# Altium project Barracuda3D.PrjPcb
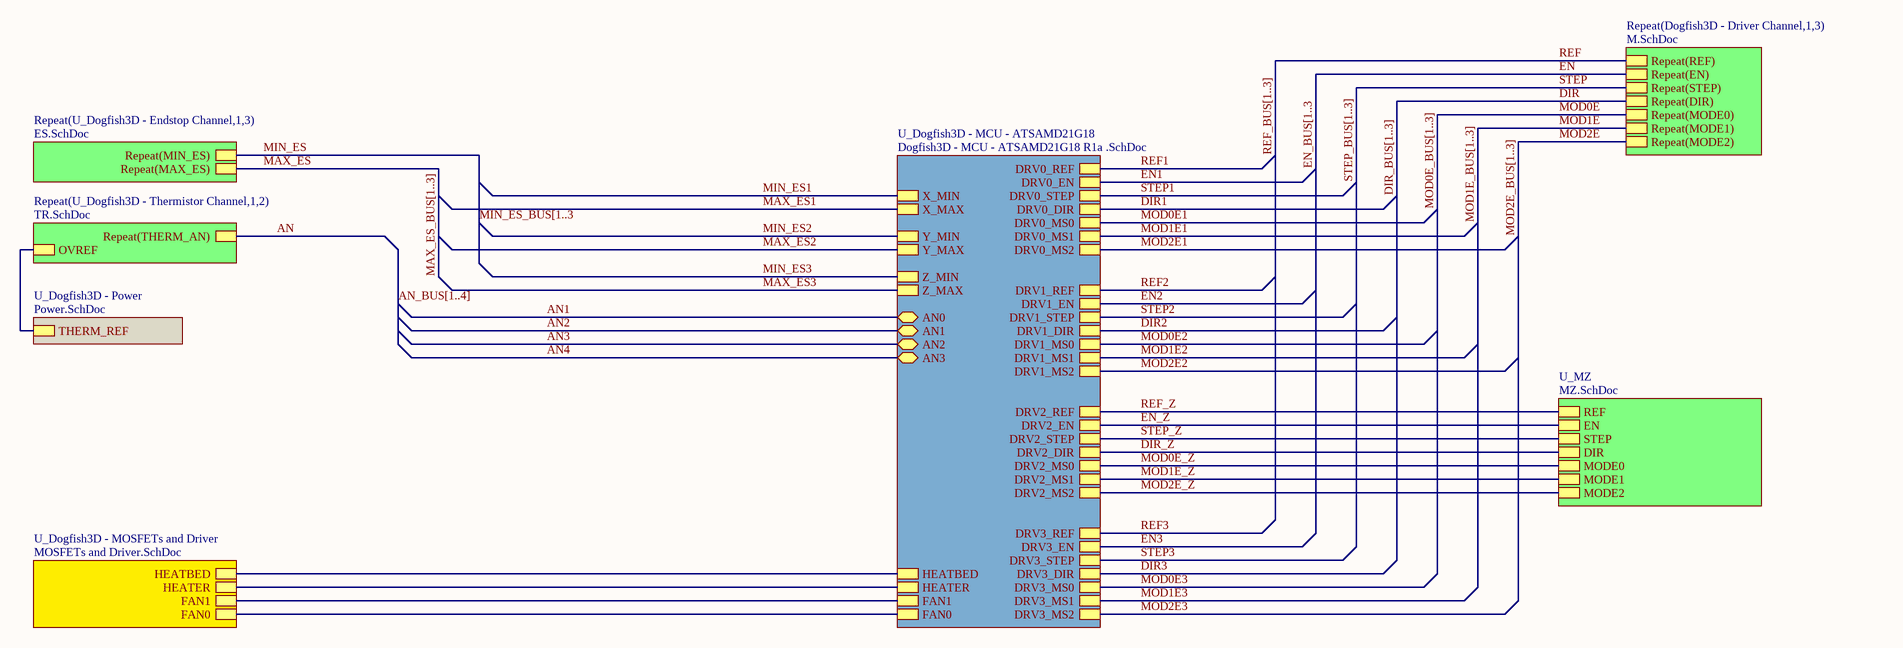
[diagram p0: Barracuda3D - System.SchDoc]
8 sheets, 225 parts. Net scope: hierarchical (ports join the sheet entries above them; power ports are global).
Board file: Barracuda3D.PcbDoc
Sheets:
  Barracuda3D - System.SchDoc
    Dogfish3D - Driver Channel1 = M.SchDoc
    Dogfish3D - Driver Channel2 = M.SchDoc
    Dogfish3D - Driver Channel3 = M.SchDoc
    U_Dogfish3D - Endstop Channel1 = ES.SchDoc
    U_Dogfish3D - Endstop Channel2 = ES.SchDoc
    U_Dogfish3D - Endstop Channel3 = ES.SchDoc
    U_Dogfish3D - MOSFETs and Driver = MOSFETs and Driver.SchDoc
    U_Dogfish3D - Power = Power.SchDoc
    U_Dogfish3D - Thermistor Channel1 = TR.SchDoc
    U_Dogfish3D - Thermistor Channel2 = TR.SchDoc
    U_Dogfish3D - MCU - ATSAMD21G18 = Dogfish3D - MCU - ATSAMD21G18 R1a .SchDoc
    U_MZ = MZ.SchDoc

## Sheet Barracuda3D - System.SchDoc
size B

### Sub-sheets
Repeat(Dogfish3D - Driver Channel,1,3) = M.SchDoc: Repeat(REF), Repeat(EN), Repeat(STEP), Repeat(DIR), Repeat(MODE0), Repeat(MODE1), Repeat(MODE2)
Repeat(U_Dogfish3D - Endstop Channel,1,3) = ES.SchDoc: Repeat(MAX_ES), Repeat(MIN_ES)
Repeat(U_Dogfish3D - Thermistor Channel,1,2) = TR.SchDoc: OVREF, Repeat(THERM_AN)
U_Dogfish3D - MCU - ATSAMD21G18 = Dogfish3D - MCU - ATSAMD21G18 R1a .SchDoc: DRV0_EN, DRV0_DIR, DRV0_STEP, DRV0_MS0, DRV0_MS1, DRV0_MS2, DRV0_REF, DRV1_EN, DRV1_DIR, DRV1_STEP, DRV1_MS0, DRV1_MS1, DRV1_MS2, DRV1_REF, DRV2_EN, DRV2_DIR, DRV2_STEP, DRV2_MS0, DRV2_MS1, DRV2_MS2, DRV2_REF, DRV3_EN, DRV3_DIR, DRV3_STEP, DRV3_MS0, DRV3_MS1, DRV3_MS2, DRV3_REF, X_MAX, X_MIN, Y_MAX, Y_MIN, Z_MAX, Z_MIN, FAN0, FAN1, HEATER, HEATBED, AN0, AN1, AN2, AN3
U_Dogfish3D - MOSFETs and Driver = MOSFETs and Driver.SchDoc: FAN0, FAN1, HEATER, HEATBED
U_Dogfish3D - Power = Power.SchDoc: THERM_REF
U_MZ = MZ.SchDoc: REF, EN, STEP, DIR, MODE0, MODE1, MODE2

### Nets
AN: sheet Repeat(U_Dogfish3D - Thermistor Channel,1,2)/Repeat(THERM_AN)
AN3: sheet U_Dogfish3D - MCU - ATSAMD21G18/AN2
AN4: sheet U_Dogfish3D - MCU - ATSAMD21G18/AN3
DIR: sheet Repeat(Dogfish3D - Driver Channel,1,3)/Repeat(DIR)
DIR_Z: sheet U_Dogfish3D - MCU - ATSAMD21G18/DRV2_DIR, sheet U_MZ/DIR
EN: sheet Repeat(Dogfish3D - Driver Channel,1,3)/Repeat(EN)
EN_Z: sheet U_Dogfish3D - MCU - ATSAMD21G18/DRV2_EN, sheet U_MZ/EN
MAX_ES: sheet Repeat(U_Dogfish3D - Endstop Channel,1,3)/Repeat(MAX_ES)
MIN_ES: sheet Repeat(U_Dogfish3D - Endstop Channel,1,3)/Repeat(MIN_ES)
MOD0E: sheet Repeat(Dogfish3D - Driver Channel,1,3)/Repeat(MODE0)
MOD0E_Z: sheet U_Dogfish3D - MCU - ATSAMD21G18/DRV2_MS0, sheet U_MZ/MODE0
MOD1E: sheet Repeat(Dogfish3D - Driver Channel,1,3)/Repeat(MODE1)
MOD1E_Z: sheet U_Dogfish3D - MCU - ATSAMD21G18/DRV2_MS1, sheet U_MZ/MODE1
MOD2E: sheet Repeat(Dogfish3D - Driver Channel,1,3)/Repeat(MODE2)
MOD2E_Z: sheet U_Dogfish3D - MCU - ATSAMD21G18/DRV2_MS2, sheet U_MZ/MODE2
PWM0: sheet U_Dogfish3D - MOSFETs and Driver/FAN0, sheet U_Dogfish3D - MCU - ATSAMD21G18/FAN0
PWM1: sheet U_Dogfish3D - MOSFETs and Driver/FAN1, sheet U_Dogfish3D - MCU - ATSAMD21G18/FAN1
PWM2: sheet U_Dogfish3D - MOSFETs and Driver/HEATER, sheet U_Dogfish3D - MCU - ATSAMD21G18/HEATER
PWM3: sheet U_Dogfish3D - MOSFETs and Driver/HEATBED, sheet U_Dogfish3D - MCU - ATSAMD21G18/HEATBED
REF: sheet Repeat(Dogfish3D - Driver Channel,1,3)/Repeat(REF)
REF_Z: sheet U_Dogfish3D - MCU - ATSAMD21G18/DRV2_REF, sheet U_MZ/REF
STEP: sheet Repeat(Dogfish3D - Driver Channel,1,3)/Repeat(STEP)
STEP_Z: sheet U_Dogfish3D - MCU - ATSAMD21G18/DRV2_STEP, sheet U_MZ/STEP
NetD18_C: sheet U_Dogfish3D - Power/THERM_REF, sheet Repeat(U_Dogfish3D - Thermistor Channel,1,2)/OVREF

### Buses and harness runs
bus AN_BUS[1..4]
bus DIR_BUS[1..3]
bus EN_BUS[1..3
bus MAX_ES_BUS[1..3]
bus MIN_ES_BUS[1..3
bus MOD0E_BUS[1..3]
bus MOD1E_BUS[1..3]
bus MOD2E_BUS[1..3]
bus REF_BUS[1..3]
bus STEP_BUS[1..3]

## Sheet M.SchDoc
size A
Used 3 times, as channels Dogfish3D - Driver Channel1, Dogfish3D - Driver Channel2, Dogfish3D - Driver Channel3. Parts and nets are listed once, with the designators drawn on the sheet.
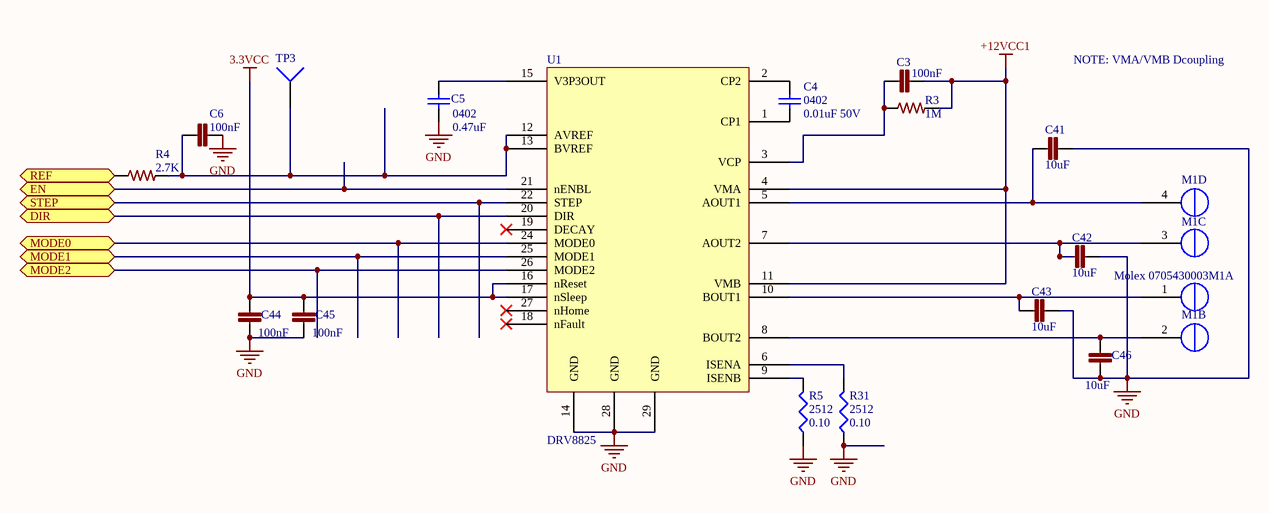
[diagram p1: M.SchDoc]

### Parts
C3  100nF  [C0603]
C4  value 0.01uF 50V  [C0402]  (hidden comment: 0402)
C5  value 0.47uF  [C0402]  (hidden comment: 0402)
C6  100nF  [C0402]
C41  10uF  [C0603]
C42  10uF  [C0603]
C43  10uF  [C0603]
C44  100nF  [C0402]
C45  100nF  [C0402]
C46  10uF  [C0603]
M1  Molex 0705430003  [4POL254]  (parts A,B,C,D of 4)
R3  1M  [R0402]
R4  2.7K  [R0402]
R5  2512  value 0.10  [2512R-0.55]
R31  2512  value 0.10  [2512R-0.55]
TP3  TP4  [TP-2]  (value not drawn)
U1  DRV8825  [DRV8825PWPR]

### Ports
DIR, EN, MODE0, MODE1, MODE2, REF, STEP

### Nets
3.3VCC: C44.1 C45.1 U1.16(nReset) U1.17(nSleep)
+12VCC1: C3.2 R3.2 U1.4(VMA) U1.11(VMB)
GND: C5.1 C6.1 C41.2 C42.2 C43.2 C44.2 C45.2 C46.2 R5.1 R31.1 U1.14(GND) U1.28(GND) U1.29(GND)
DIR: U1.20(DIR) ; port DIR
EN: U1.21(nENBL) ; port EN
MODE0: U1.24(MODE0) ; port MODE0
MODE1: U1.25(MODE1) ; port MODE1
MODE2: U1.26(MODE2) ; port MODE2
REF: R4.1 ; port REF
STEP: U1.22(STEP) ; port STEP
NetC3_1: C3.1 R3.1 U1.3(VCP)
NetC4_1: C4.1 U1.1(CP1)
NetC4_2: C4.2 U1.2(CP2)
NetC5_2: C5.2 U1.15(V3P3OUT)
NetC6_2: C6.2 R4.2 TP3.1 U1.12(AVREF) U1.13(BVREF)
NetC41_1: C41.1 M1.4(OUT1B) U1.5(AOUT1)
NetC42_1: C42.1 M1.3(OUT1A) U1.7(AOUT2)
NetC43_1: C43.1 M1.1(OUT2B) U1.10(BOUT1)
NetC46_1: C46.1 M1.2(OUT2A) U1.8(BOUT2)
NetR5_2: R5.2 U1.9(ISENB)
NetR31_2: R31.2 U1.6(ISENA)

Not connected (* = marked no-connect by the designer): U1 18(nFault)* 19(DECAY)* 23(NC) 27(nHome)*

### Channels
Dogfish3D - Driver Channel1: designators end in D; ports DIR=DIR1 EN=EN1 MODE0=MOD0E1 MODE1=MOD1E1 MODE2=MOD2E1 REF=REF1 STEP=STEP1
Dogfish3D - Driver Channel2: designators end in B; ports DIR=DIR2 EN=EN2 MODE0=MOD0E2 MODE1=MOD1E2 MODE2=MOD2E2 REF=REF2 STEP=STEP2
Dogfish3D - Driver Channel3: designators end in C; ports DIR=DIR3 EN=EN3 MODE0=MOD0E3 MODE1=MOD1E3 MODE2=MOD2E3 REF=E0_DRV_REF STEP=STEP3

### Notes on the sheet
- NOTE: VMA/VMB Dcoupling

### Library data of the parts
C3 = C0603C104K5RACTU: CAP CER 0603 100nF 50V 10% X7R; LastRevisionNote: ImportComponents; Published: 23-Apr-2014; Publisher: UltiMachine; LastRevisionDate: 23-Apr-2014; ManufacturerPartNumber: C0603C104K5RACTU; VALUE: 100nF
C4 = GRM155R71H103JA88D: CAP CER 10000PF 50V X7R 0402; MFR: Murata; Tolerance: 10%; Voltage: 6.3VDC; Published: 10 - Dec - 2014; LatestRevisionDate: 10 - Dec - 2014; LatestRevisionNote: Ultimachine Footprint Added; Publisher: Ultimachine; Component Type: Chip Capacitor; MFR Part #: GRM155R71H103JA88D; Part Description: CAP CER 10000PF 50V X7R 0402; Mounting Type: SMT 0402; Datasheet: http://search.murata.co.jp/Ceramy/image/img/A01X/G101/ENG/GRM155R71H103JA88-01.pdf; Height: 0.5 ±0.05mm; Digikey #: 490-7763-1-ND; PackageReference: 0402
C5 = GRM155R60J474KE19D: 0.47uF 6.3v C0402 - GRM155R60J474KE19D; MFR: Murata; Part Description: CAP CER 0.47UF 6.3V 10% X5R 0402; Tolerance: 10%; Voltage: 6.3VDC; Published: 10 - Dec - 2014; LatestRevisionDate: 10 - Dec - 2014; LatestRevisionNote: Ultimachine Footprint Added; Publisher: Ultimachine; Component Type: Chip Capacitor; MFR Part #: GRM155R60J474KE19D; Mounting Type: SMT 0402; Datasheet: http://search.murata.co.jp/Ceramy/image/img/A01X/G101/ENG/GRM155R60J474KE19-01.pdf; Height: 0.5 ±0.05mm; PackageReference: 0402
C6 C44 C45 = GRM155R71C104KA88D: CAP CER 0402 100nF 16V 10% X7R; LastRevisionNote: ImportComponents; Published: 23-Apr-2014; Publisher: UltiMachine; LastRevisionDate: 23-Apr-2014; ManufacturerPartNumber: GRM155R71C104KA88D; VALUE: 100nF
C41-C43 C46 = CC0603ZRY5V6BB105: CAP CER 0603 1uF 10V Y5V; LastRevisionNote: ImportComponents; Published: 23-Apr-2014; Publisher: UltiMachine; LastRevisionDate: 23-Apr-2014; ManufacturerPartNumber: CC0603ZRY5V6BB105; VALUE: 10uF
M1 = Molex 0705430003 Alt: Molex 4 Pin Clip Connector
R3 = ERJ2GEJ105X: RES 0402 1M 100mW 5%; LastRevisionNote: ImportComponents; Published: 23-Apr-2014; Publisher: UltiMachine; LastRevisionDate: 23-Apr-2014; ManufacturerPartNumber: ERJ2GEJ105X; VALUE: 1M
R4 = ERJ-2RKF2701X: RES SMD 2.7K OHM 1% 1/10W 0402; Manufacturer: Panasonic; ManufacturerPartNumber: ERJ2GEJ105X; LastRevisionNote: ImportComponents; Published: 23-Apr-2014; Publisher: Adam; LastRevisionDate: 23-Apr-2014; VALUE: 2.7K
R5 R31 = CSRN2512FTR100: RES SMD 0.1 OHM 1% 2W 2512; MFR: Stackpole ELectronics Inc; PackageReference: 2512; MFR #: CSRN2512FTR100; Digikey #: CSRN2512FTR100TR-ND; PDF: http://www.seielect.com/catalog/SEI-CSR_CSRN.pdf
TP3 = Socket: LatestRevisionDate: 17-Jul-2002; LatestRevisionNote: Re-released for DXP Platform.; Publisher: Altium Limited
U1 = DRV8825: DRV8825 Ti Stepper Driver; Manufacture: Texas Instruments; Mountining Type: SMD - Ti PowerPAD Package; Voltage: 8.2-45VDC; Cost (1000 qty): 2.25; Part Number: DRV8825PWPR; Status: In-Production; Pins: 28 Pins and one Exposed Pad; Datasheet: http://www.ti.com/lit/gpn/drv8825; Height: 1.2mm; Tolerance: N/A; Type: Stepper Driver - Integrated Circuit; Lead Free: YES

## Sheet ES.SchDoc
size A
Used 3 times, as channels U_Dogfish3D - Endstop Channel1, U_Dogfish3D - Endstop Channel2, U_Dogfish3D - Endstop Channel3. Parts and nets are listed once, with the designators drawn on the sheet.
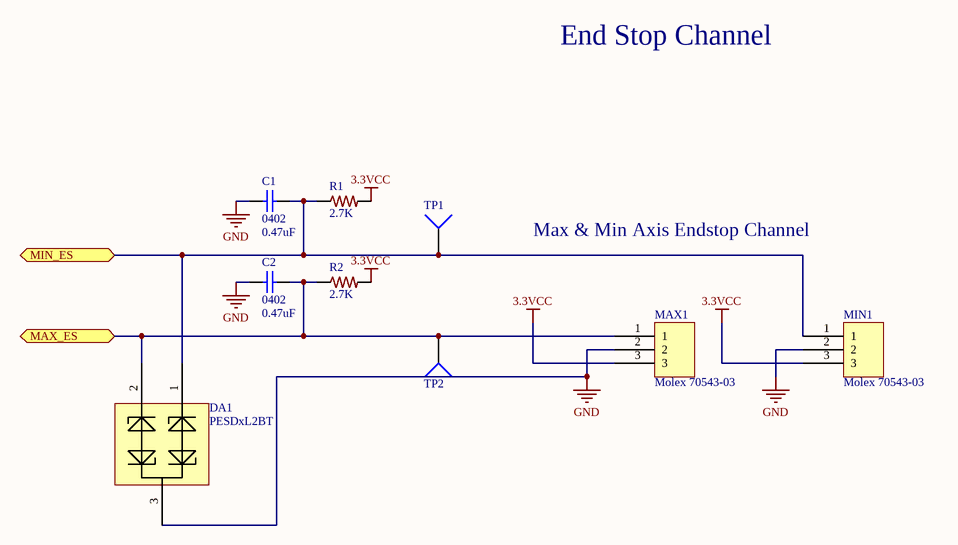
[diagram p2: ES.SchDoc]

### Parts
C1  value 0.47uF  [C0402]  (hidden comment: 0402)
C2  value 0.47uF  [C0402]  (hidden comment: 0402)
DA1  PESDxL2BT  [SOT95P230X110-3N]
MAX1  Molex 70543-03  [70543-03]
MIN1  Molex 70543-03  [70543-03]
R1  2.7K  [R0402]
R2  2.7K  [R0402]
TP1  TP4  [TP-2]  (value not drawn)
TP2  TP4  [TP-2]  (value not drawn)

### Ports
MAX_ES, MIN_ES

### Nets
3.3VCC: MAX1.3 MIN1.3 R1.2 R2.2
GND: C1.2 C2.2 DA1.3 MAX1.2 MIN1.2
MAX_ES: C2.1 DA1.2 MAX1.1 R2.1 TP2.1 ; port MAX_ES
MIN_ES: C1.1 DA1.1 MIN1.1 R1.1 TP1.1 ; port MIN_ES

### Channels
U_Dogfish3D - Endstop Channel1: designators end in A; ports MAX_ES=MAX_ES1 MIN_ES=MIN_ES1
U_Dogfish3D - Endstop Channel2: designators end in B; ports MAX_ES=MAX_ES2 MIN_ES=MIN_ES2
U_Dogfish3D - Endstop Channel3: designators end in C; ports MAX_ES=MAX_ES3 MIN_ES=MIN_ES3

### Notes on the sheet
- End Stop Channel
- Max & Min Axis Endstop Channel

### Library data of the parts
C1 C2 = GRM155R60J474KE19D: as C5 on sheet M; Published: 10 - Dec - 2014; LatestRevisionDate: 10 - Dec - 2014; LatestRevisionNote: Ultimachine Footprint Added; Publisher: Ultimachine; Component Type: Chip Capacitor; MFR Part #: GRM155R60J474KE19D; Mounting Type: SMT 0402; Datasheet: http://search.murata.co.jp/Ceramy/image/img/A01X/G101/ENG/GRM155R60J474KE19-01.pdf; Height: 0.5 ±0.05mm; PackageReference: 0402
DA1 = PESDxL2BT: PESDxL2BT TVS Diode Array 2x
MAX1 MIN1 = Molex Endstop
R1 R2 = ERJ-2GEJ272X: RES SMD 2.7K OHM 5% 1/10W 0402; LastRevisionNote: ImportComponents; Published: 23-Apr-2014; Publisher: Adam Vadala-Roth; LastRevisionDate: 23-Apr-2014; ManufacturerPartNumber: ERJ-2GEJ272X; Digikey #: P2.7KJCT-ND; Tolerance: 5%; Mounting type: SMD; VALUE: 2.7K
TP1 TP2 = Socket: LatestRevisionDate: 17-Jul-2002; LatestRevisionNote: Re-released for DXP Platform.; Publisher: Altium Limited

## Sheet MOSFETs and Driver.SchDoc
size A
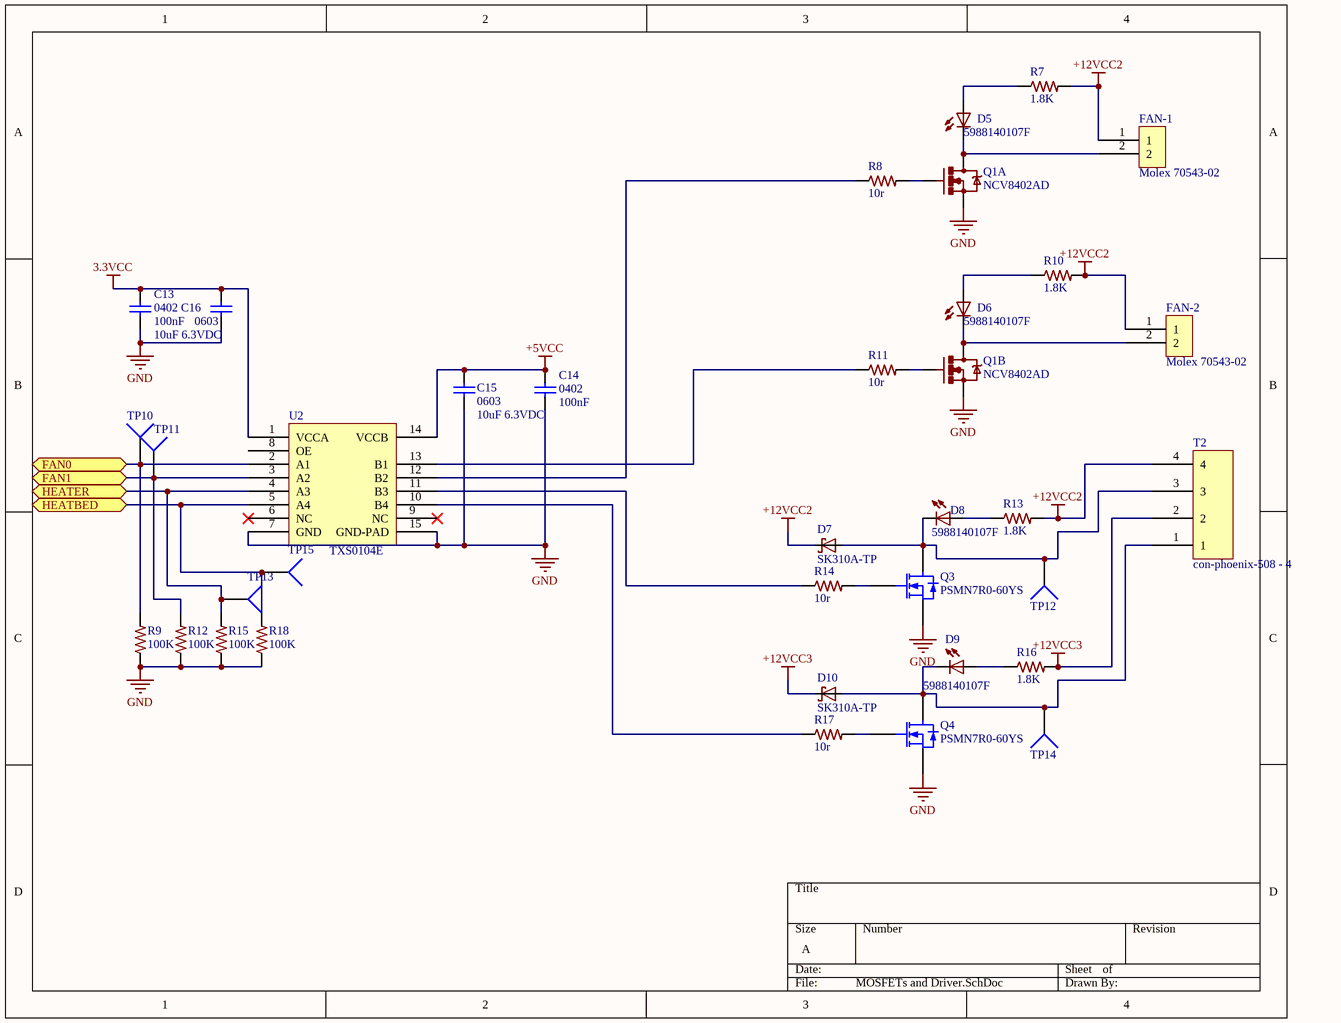
[diagram p3: MOSFETs and Driver.SchDoc]

### Parts
C13  value 100nF  [C0402]  (hidden comment: 0402)
C14  value 100nF  [C0402]  (hidden comment: 0402)
C15  0603  value 10uF 6.3VDC  [C0603]
C16  0603  value 10uF 6.3VDC  [C0603]
D5  5988140107F  [LED2012120]
D6  5988140107F  [LED2012120]
D7  SK310A-TP  [SMA-SM]
D8  5988140107F  [LED2012120]
D9  5988140107F  [LED2012120]
D10  SK310A-TP  [SMA-SM]
FAN-1  Molex 70543-02  [70543-02]
FAN-2  Molex 70543-02  [70543-02]
Q1  NCV8402AD  [NCV8402AD-SOIC8]  (parts A,B of 2)
Q3  PSMN7R0-60YS  [PSMN7R0-60YS]
Q4  PSMN7R0-60YS  [PSMN7R0-60YS]
R7  1.8K  [R0603]
R8  10r  [R0603]
R9  100K  [R0402]
R10  1.8K  [R0603]
R11  10r  [R0603]
R12  100K  [R0402]
R13  1.8K  [R0603]
R14  10r  [R0603]
R15  100K  [R0402]
R16  1.8K  [R0603]
R17  10r  [R0603]
R18  100K  [R0402]
T2  con-phoenix-508 - 4  [MSTBV4]
TP10  TP4  [TP-2]  (value not drawn)
TP11  TP4  [TP-2]  (value not drawn)
TP12  TP4  [TP-2]  (value not drawn)
TP13  TP4  [TP-2]  (value not drawn)
TP14  TP4  [TP-2]  (value not drawn)
TP15  TP4  [TP-2]  (value not drawn)
U2  TXS0104E  [RGY  (S-PVQFN-N14)]

### Ports
FAN0, FAN1, HEATBED, HEATER

### Nets
3.3VCC: C13.2 C16.2 U2.1(VCCA)
+5VCC: C14.2 C15.2 U2.14(VCCB)
+12VCC2: D7.C FAN-1.1 FAN-2.1 R7.2 R10.2 R13.2 T2.4
+12VCC3: D10.C R16.2 T2.2
GND: C13.1 C14.1 C15.1 C16.1 Q1.1(S) Q1.3(S) Q3.1(S) Q3.2(S) Q3.3(S) Q4.1(S) Q4.2(S) Q4.3(S) R9.1 R12.1 R15.1 R18.1 U2.7(GND) U2.15(GND-PAD)
PWM0: R9.2 TP10.1 U2.2(A1) ; port FAN0
PWM1: R12.2 TP11.1 U2.3(A2) ; port FAN1
PWM2: R15.2 TP13.1 U2.4(A3) ; port HEATER
PWM3: R18.2 TP15.1 U2.5(A4) ; port HEATBED
NetD5_A: D5.A R7.1
NetD5_C: D5.C FAN-1.2 Q1.7(D)
NetD6_A: D6.A R10.1
NetD6_C: D6.C FAN-2.2 Q1.5(D)
NetD7_A: D7.A D8.C Q3.5(D) T2.3 TP12.1
NetD8_A: D8.A R13.1
NetD9_A: D9.A R16.1
NetD9_C: D9.C D10.A Q4.5(D) T2.1 TP14.1
NetQ1_2: Q1.2(G) R8.2
NetQ1_4: Q1.4(G) R11.2
NetQ3_4: Q3.4(G) R14.2
NetQ4_4: Q4.4(G) R17.2
NetR8_1: R8.1 U2.12(B2)
NetR11_1: R11.1 U2.13(B1)
NetR14_1: R14.1 U2.11(B3)
NetR17_1: R17.1 U2.10(B4)

Not connected (* = marked no-connect by the designer): U2 6(NC)* 8(OE) 9(NC)*

### Library data of the parts
C13 C14 = GRM155R71C104KA88D: CAP CER 0.1UF (100nF) 16V 10% X7R 0402; MFR: Murata; Part Description: CAP CER 0.1UF 16V 10% X7R 0402; Published: 10 - Dec - 2014; LatestRevisionDate: 10 - Dec - 2014; LatestRevisionNote: Ultimachine Footprint Added; Publisher: Ultimachine; Component Type: Chip Capacitor; MFR Part #: GRM155R71C104KA88D; Mounting Type: SMT 0402; Datasheet: http://psearch.murata.com/capacitor/product/GRM155R71C104KA88%23.pdf; Height: 0.5 ±0.05mm; Tolerance: 10%; Voltage: 16v; PackageReference: 0402
C15 C16 = C1608JB0J106K080AB: CAP CER 10UF 6.3V 10% JB 0603; MFR: TDK; Voltage: 6.3VDC; Published: 10 - Dec - 2014; LatestRevisionDate: 10 - Dec - 2014; Component Type: Chip Capacitor; MFR Part #: C1608JB0J106K080AB; Part Description: CAP CER 10UF 6.3V 10% JB 0603; Mounting Type: SMT 0603; Datasheet: http://www.tdk.com/pdf/TDKMLCCCapRange.pdf; Height: 0.9mm; Tolerance: 10%; Digikey #: 445-11185-1-ND; PackageReference: 0402
D5 D6 D8 D9 = 5988140107F: LED 0805 Yellow; LastRevisionNote: ImportComponents; Published: 23-Apr-2014; Publisher: UltiMachine; LastRevisionDate: 23-Apr-2014; VALUE: 5988140107F
D7 D10 = SK310A: DIODE Schottky 3A SMA; LastRevisionNote: ImportComponents; LastRevisionDate: 23-Apr-2014; ManufacturerPartNumber: SK310A; Published: 23-Apr-2014; Publisher: UltiMachine
Q3 Q4 = PSMN7R0-60YS: N-Channel MOSFET; Published: 8-Jun-2000; LatestRevisionDate: 17-Jul-2002; LatestRevisionNote: Re-released for DXP Platform.; PackageVersion: 1995/1996; PackageReference: E3; Publisher: Altium Limited; PackageDescription: TO, Flat Index; 3 In-Line, Axial Leads; Body Dia. 4.6mm; Lead Dia. 0.5 mm (max)
R7 R10 R13 R16 = RC0603JR-071K8L: RES 0603 1.8K 100mW 5%; LastRevisionNote: ImportComponents; Published: 23-Apr-2014; Publisher: UltiMachine; LastRevisionDate: 23-Apr-2014; ManufacturerPartNumber: RC0603JR-071K8L; VALUE: 1.8K
R8 R11 R14 R17 = CRCW060310R0FKEA: RES 0603 10r 100mW 1%; LastRevisionNote: ImportComponents; Published: 23-Apr-2014; Publisher: UltiMachine; LastRevisionDate: 23-Apr-2014; ManufacturerPartNumber: CRCW060310R0FKEA; VALUE: 10r
R9 R12 R15 R18 = RC1005F104CS: RES SMD 100K OHM 1% 1/16W 0402; Manufacturer: Samsung; LastRevisionNote: ImportComponents; Digilkey #: 1276-3432-1-ND; Published: 23-Apr-2014; Publisher: UltiMachine; LastRevisionDate: 23-Apr-2014; ManufacturerPartNumber: RC1005F104CS; VALUE: 100K
T2 = con-phoenix-508_4
TP10-TP15 = Socket: LatestRevisionDate: 17-Jul-2002; LatestRevisionNote: Re-released for DXP Platform.; Publisher: Altium Limited
U2 = TXS0104E: TXS0104E - Bidriectional Opendrain/pushpull level shift; MFR: Texas Instruments; MFR Part #: TXS0104ERGYR; Active: Yes; Digikey Part #: 296-20698-2-ND; Height: 1mm; mounting Type: SMD; Datasheet: http://www.ti.com/lit/ds/symlink/txs0104e.pdf; Lead Free ?: RhoS

## Sheet Power.SchDoc
size A
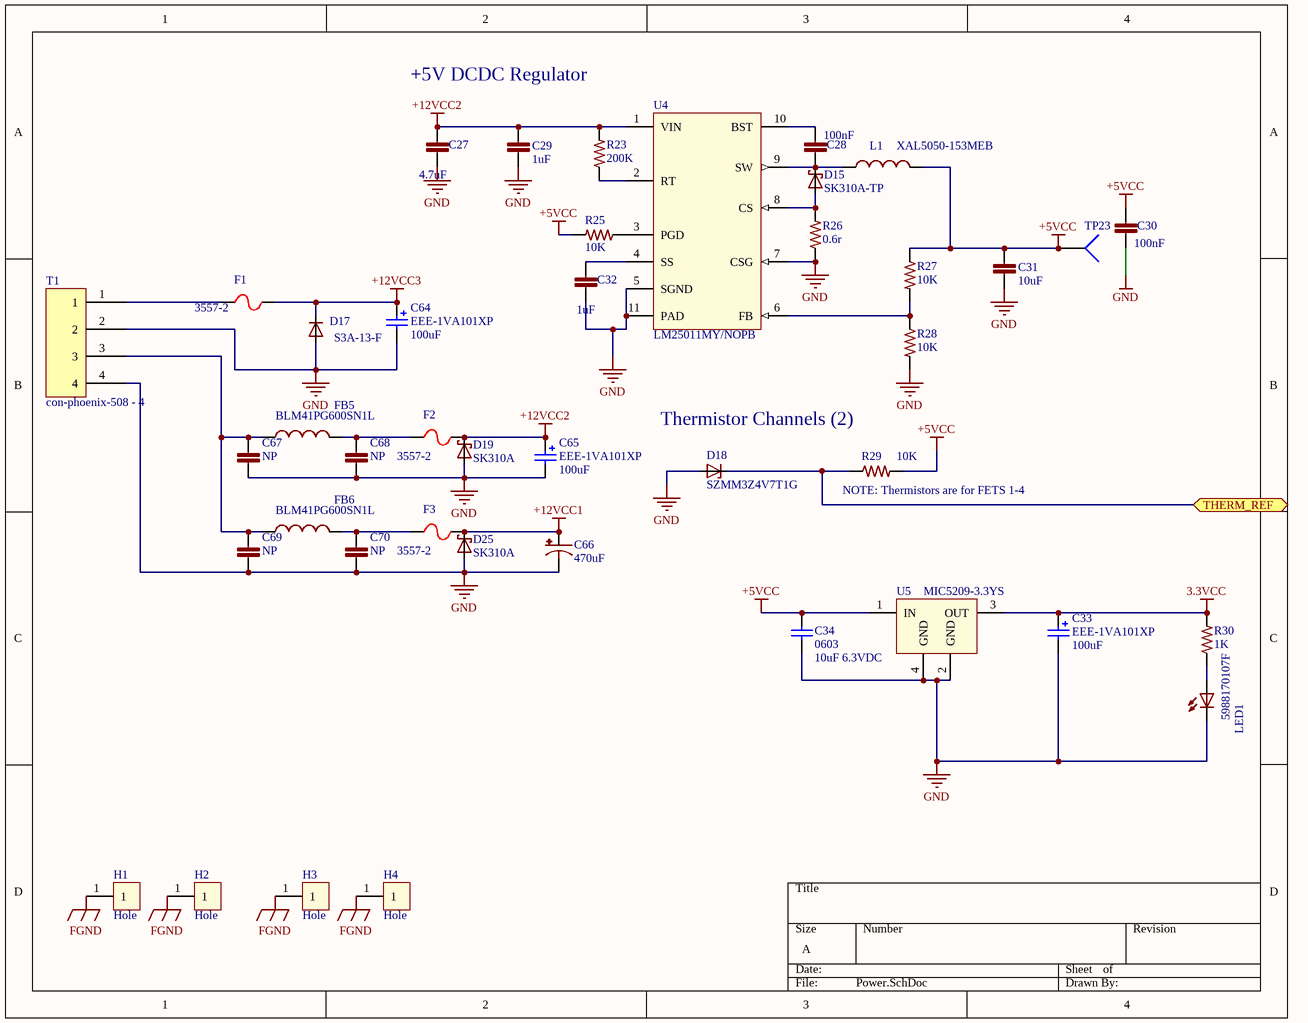
[diagram p4: Power.SchDoc]

### Parts
C27  4.7uF  [C1206]
C28  100nF  [C0603]
C29  1uF  [C0805]
C30  100nF  [C0603]
C31  10uF  [C0805]
C32  1uF  [C0402]
C33  EEE-1VA101XP  value 100uF  [EEE-1VA101XP]
C34  0603  value 10uF 6.3VDC  [C0603]
C64  EEE-1VA101XP  value 100uF  [EEE-1VA101XP]
C65  EEE-1VA101XP  value 100uF  [EEE-1VA101XP]
C66  470uF  [C12,5-5]
C67  NP  [C0603]
C68  NP  [C0603]
C69  NP  [C0603]
C70  NP  [C0603]
D15  SK310A-TP  [SMA-SM]
D17  S3A-13-F  [DO-214AB]
D18  SZMM3Z4V7T1G  [SOD323-R]
D19  SK310A  [SMA-SM]
D25  SK310A  [SMA-SM]
F1  3557-2  [3557]
F2  3557-2  [3557]
F3  3557-2  [3557]
FB5  BLM41PG600SN1L  [L1806]
FB6  BLM41PG600SN1L  [L1806]
H1  Hole  [Wave_hole_3x7-singleSided]  (no BOM)
H2  Hole  [Wave_hole_3x7-singleSided]  (no BOM)
H3  Hole  [Wave_hole_3x7-singleSided]  (no BOM)
H4  Hole  [Wave_hole_3x7-singleSided]  (no BOM)
L1  XAL5050-153MEB  [XAL50xx-153]
LED1  5988170107F  [LED2012120]
R23  200K  [R0402]
R25  10K  [R0603]
R26  0.6r  [2512R-0.55]
R27  10K  [R0603]
R28  10K  [R0603]
R29  10K  [R0603]
R30  1K  [R0603]
T1  con-phoenix-508 - 4  [MSTBV4]
TP23  TP4  [TP-2]  (value not drawn)
U4  LM25011MY/NOPB  [VSSOP10]
U5  MIC5209-3.3YS  [SOT230P700X190-4N]

### Ports
THERM_REF

### Nets
3.3VCC: C33.1 R30.2 U5.3(OUT)
+5VCC: C30.1 C31.1 C34.2 L1.2 R25.2 R27.1 R29.2 TP23.1 U5.1(IN)
+12VCC1: C66.1(+) D25.C F3.2
+12VCC2: C27.1 C29.1 C65.1 D19.C F2.2 R23.2 U4.1(VIN)
+12VCC3: C64.1 D17.C F1.2
FGND: H1.1 H2.1 H3.1 H4.1
GND: C27.2 C29.2 C30.2 C31.2 C32.2 C33.2 C34.1 C64.2 C65.2 C66.2(-) C67.2 C68.2 C69.2 C70.2 D17.A D18.A D19.A D25.A LED1.C R26.1 R28.2 T1.2 T1.4 U4.5(SGND) U4.7(CSG) U4.11(PAD) U5.2(GND) U5.4(GND)
NetC28_1: C28.1 U4.10(BST)
NetC28_2: C28.2 D15.C L1.1 U4.9(SW)
NetC32_1: C32.1 U4.4(SS)
NetC67_1: C67.1 C69.1 FB5.1 FB6.1 T1.3
NetC68_1: C68.1 F2.1 FB5.2
NetC70_1: C70.1 F3.1 FB6.2
NetD15_A: D15.A R26.2 U4.8(CS)
NetD18_C: D18.C R29.1 ; port THERM_REF
NetF1_1: F1.1 T1.1
NetLED1_A: LED1.A R30.1
NetR23_1: R23.1 U4.2(RT)
NetR25_1: R25.1 U4.3(PGD)
NetR27_2: R27.2 R28.1 U4.6(FB)

### Notes on the sheet
- +5V DCDC Regulator
- Thermistor Channels (2)
- (near R29) NOTE: Thermistors are for FETS 1-4

### Library data of the parts
C27 = C1206C475K5PACTU: CAP CER 1206 4.7uF 50V 10% X5R; LastRevisionNote: ImportComponents; Published: 23-Apr-2014; Publisher: UltiMachine; LastRevisionDate: 23-Apr-2014; ManufacturerPartNumber: C1206C475K5PACTU; VALUE: 4.7uF
C28 C30 C67-C70 = C0603C104K5RACTU: as C3 on sheet M; Published: 23-Apr-2014; Publisher: UltiMachine; LastRevisionDate: 23-Apr-2014; ManufacturerPartNumber: C0603C104K5RACTU
  C28 C30: VALUE: 100nF
  C67-C70: VALUE: NP
C29 = GRM21BR71H105KA12L: CAP CER 0805 1uF 50V 10% X7R; LastRevisionNote: ImportComponents; Published: 23-Apr-2014; Publisher: UltiMachine; LastRevisionDate: 23-Apr-2014; ManufacturerPartNumber: GRM21BR71H105KA12L; VALUE: 1uF
C31 = C0805C106K8PACTU: CAP CER 0805 10uF 10V 10% X5R; LastRevisionNote: ImportComponents; Published: 23-Apr-2014; Publisher: UltiMachine; LastRevisionDate: 23-Apr-2014; ManufacturerPartNumber: C0805C106K8PACTU; VALUE: 10uF
C32 = GRM155R60J105KE19D: CAP CER 0402 1uF 6.3V 10% X5R; LastRevisionNote: ImportComponents; Published: 23-Apr-2014; Publisher: UltiMachine; LastRevisionDate: 23-Apr-2014; ManufacturerPartNumber: GRM155R60J105KE19D; VALUE: 1uF
C33 C64 C65 = EEE-1VA101XP: CAP ALUM 100UF 35V 20% SMD; Manufacture: Panasonic; Digikey Part #: PCE3951CT-ND; Price: $0.63; Mount Type: SMT Panasonic VS D Series; Status: Active; Height: 7.70mm; Datasheet: http://industrial.panasonic.com/www-cgi/jvcr13pz.cgi?E+PZ+3+ABA0002+EEE1VA101XP+7+WW; Manufacture Part #: EEE-1VA101XP
C34 = C1608JB0J106K080AB: as C15 on sheet MOSFETs and Driver; Published: 10 - Dec - 2014; LatestRevisionDate: 10 - Dec - 2014; Component Type: Chip Capacitor; MFR Part #: C1608JB0J106K080AB; Part Description: CAP CER 10UF 6.3V 10% JB 0603; Mounting Type: SMT 0603; Datasheet: http://www.tdk.com/pdf/TDKMLCCCapRange.pdf; Height: 0.9mm; Tolerance: 10%; Digikey #: 445-11185-1-ND; PackageReference: 0402
C66 = UPW1H471MHD1TO: CAP ALU 470uF 50V 20%; LastRevisionNote: ImportComponents; Published: 23-Apr-2014; Publisher: UltiMachine; LastRevisionDate: 23-Apr-2014; ManufacturerPartNumber: UPW1H471MHD1TO; VALUE: 470uF
D15 D19 D25 = SK310A: as D7 on sheet MOSFETs and Driver; LastRevisionDate: 23-Apr-2014; ManufacturerPartNumber: SK310A; Published: 23-Apr-2014; Publisher: UltiMachine
D17 = S3A-13-F: DIODE DO-214AB; LastRevisionNote: ImportComponents; Published: 23-Apr-2014; Publisher: UltiMachine; LastRevisionDate: 23-Apr-2014; Value: S3A-13-F
D18 = SZMM3Z4V7T1G: Z-Diode; Manufacturer: Fairchild; LastRevisionNote: ImportComponents; Published: 23-Apr-2014; Publisher: UltiMachine; LastRevisionDate: 23-Apr-2014
F1-F3 = 3557-2: FUSE PTH ATO; LastRevisionNote: ImportComponents; Published: 23-Apr-2014; Publisher: UltiMachine; LastRevisionDate: 23-Apr-2014; ManufacturerPartNumber: 3557-2
FB5 FB6 = BLM41PG600SN1L: FERRITE BEAD 1806 60ohm; LastRevisionNote: ImportComponents; Published: 23-Apr-2014; Publisher: UltiMachine; LastRevisionDate: 23-Apr-2014; ManufacturerPartNumber: BLM41PG600SN1L
L1 = XAL5050-153MEB: IND 15uH 3.9A 20%; LastRevisionNote: ImportComponents; Published: 23-Apr-2014; Publisher: UltiMachine; LastRevisionDate: 23-Apr-2014; ManufacturerPartNumber: XAL5050-153MEB; Value: XAL5050-153MEB
LED1 = 5988170107F: LED 0805 Green; LastRevisionNote: ImportComponents; Published: 23-Apr-2014; Publisher: UltiMachine; LastRevisionDate: 23-Apr-2014; VALUE: 5988170107F
R23 = CRCW0402200KFKED: RES 0402 22r 63mW 1%; LastRevisionNote: ImportComponents; Published: 23-Apr-2014; Publisher: UltiMachine; LastRevisionDate: 23-Apr-2014; ManufacturerPartNumber: CRCW0402200KFKED; VALUE: 200K
R25 R27-R29 = ERJ-3EKF1002V: RES 0603 10K 100mW 1%; LastRevisionNote: ImportComponents; Published: 23-Apr-2014; Publisher: UltiMachine; LastRevisionDate: 23-Apr-2014; ManufacturerPartNumber: ERJ-3EKF1002V; VALUE: 10K
R26 = RL2512FK-070R06L: RES 0.06 OHM 1W 1% 2512 SMD; LastRevisionNote: ImportComponents; Published: 23-Apr-2014; Publisher: UltiMachine; LastRevisionDate: 23-Apr-2014; ManufacturerPartNumber: RL2512FK-070R06L; VALUE: 0.6r
R30 = ERJ-3EKF1001V: RES 0603 1K 100mW 1%; LastRevisionNote: ImportComponents; Published: 23-Apr-2014; Publisher: UltiMachine; LastRevisionDate: 23-Apr-2014; ManufacturerPartNumber: ERJ-3EKF1001V; VALUE: 1K
T1 = con-phoenix-508_4
TP23 = Socket: LatestRevisionDate: 17-Jul-2002; LatestRevisionNote: Re-released for DXP Platform.; Publisher: Altium Limited
U4 = LM25011: REG BUCK; Value: LM25011MY/NOPB

## Sheet TR.SchDoc
size A
Used 2 times, as channels U_Dogfish3D - Thermistor Channel1, U_Dogfish3D - Thermistor Channel2. Parts and nets are listed once, with the designators drawn on the sheet.
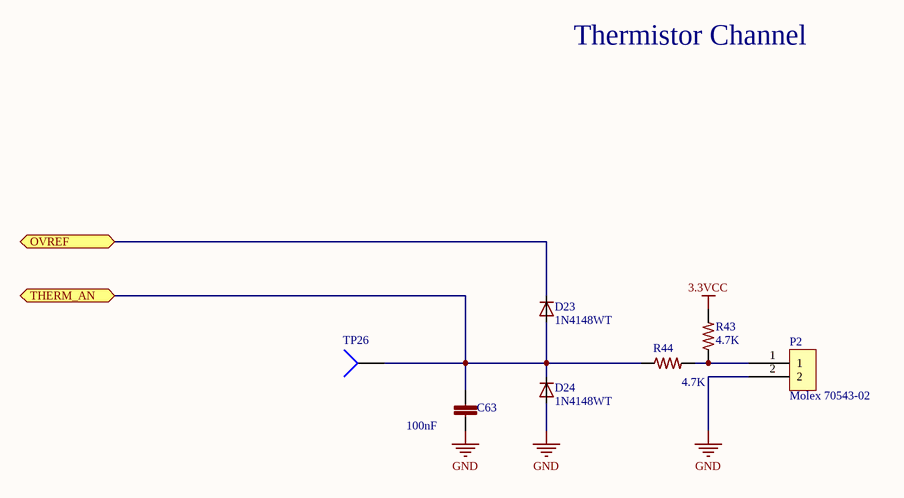
[diagram p5: TR.SchDoc]

### Parts
C63  100nF  [C0402]
D23  1N4148WT  [SOD523]
D24  1N4148WT  [SOD523]
P2  Molex 70543-02  [70543-02]
R43  4.7K  [R0603]
R44  4.7K  [R0603]
TP26  TP4  [TP-2]  (value not drawn)

### Ports
OVREF, THERM_AN

### Nets
3.3VCC: R43.2
GND: C63.2 D24.A P2.2
OVREF: D23.C ; port OVREF
THERM_AN: C63.1 D23.A D24.C R44.1 TP26.1 ; port THERM_AN
NetP2_1: P2.1 R43.1 R44.2

### Channels
U_Dogfish3D - Thermistor Channel1: designators end in A; ports OVREF=NetD18_C THERM_AN=AN1
U_Dogfish3D - Thermistor Channel2: designators end in B; ports OVREF=NetD18_C THERM_AN=AN2

### Notes on the sheet
- Thermistor Channel

### Library data of the parts
C63 = GRM155R71C104KA88D: as C6 on sheet M; Published: 23-Apr-2014; Publisher: UltiMachine; LastRevisionDate: 23-Apr-2014; ManufacturerPartNumber: GRM155R71C104KA88D; VALUE: 100nF
D23 D24 = 1N4148WT: DIODE SOD523; LastRevisionNote: ImportComponents; Published: 23-Apr-2014; Publisher: UltiMachine; LastRevisionDate: 23-Apr-2014; Value: 1N4148WT
R43 R44 = ERJ3EKF4701V: RES 0603 4.7K 100mW 1%; LastRevisionNote: ImportComponents; Published: 23-Apr-2014; Publisher: UltiMachine; LastRevisionDate: 23-Apr-2014; ManufacturerPartNumber: ERJ3EKF4701V; VALUE: 4.7K
TP26 = Socket: LatestRevisionDate: 17-Jul-2002; LatestRevisionNote: Re-released for DXP Platform.; Publisher: Altium Limited

## Sheet Dogfish3D - MCU - ATSAMD21G18 R1a .SchDoc
size B
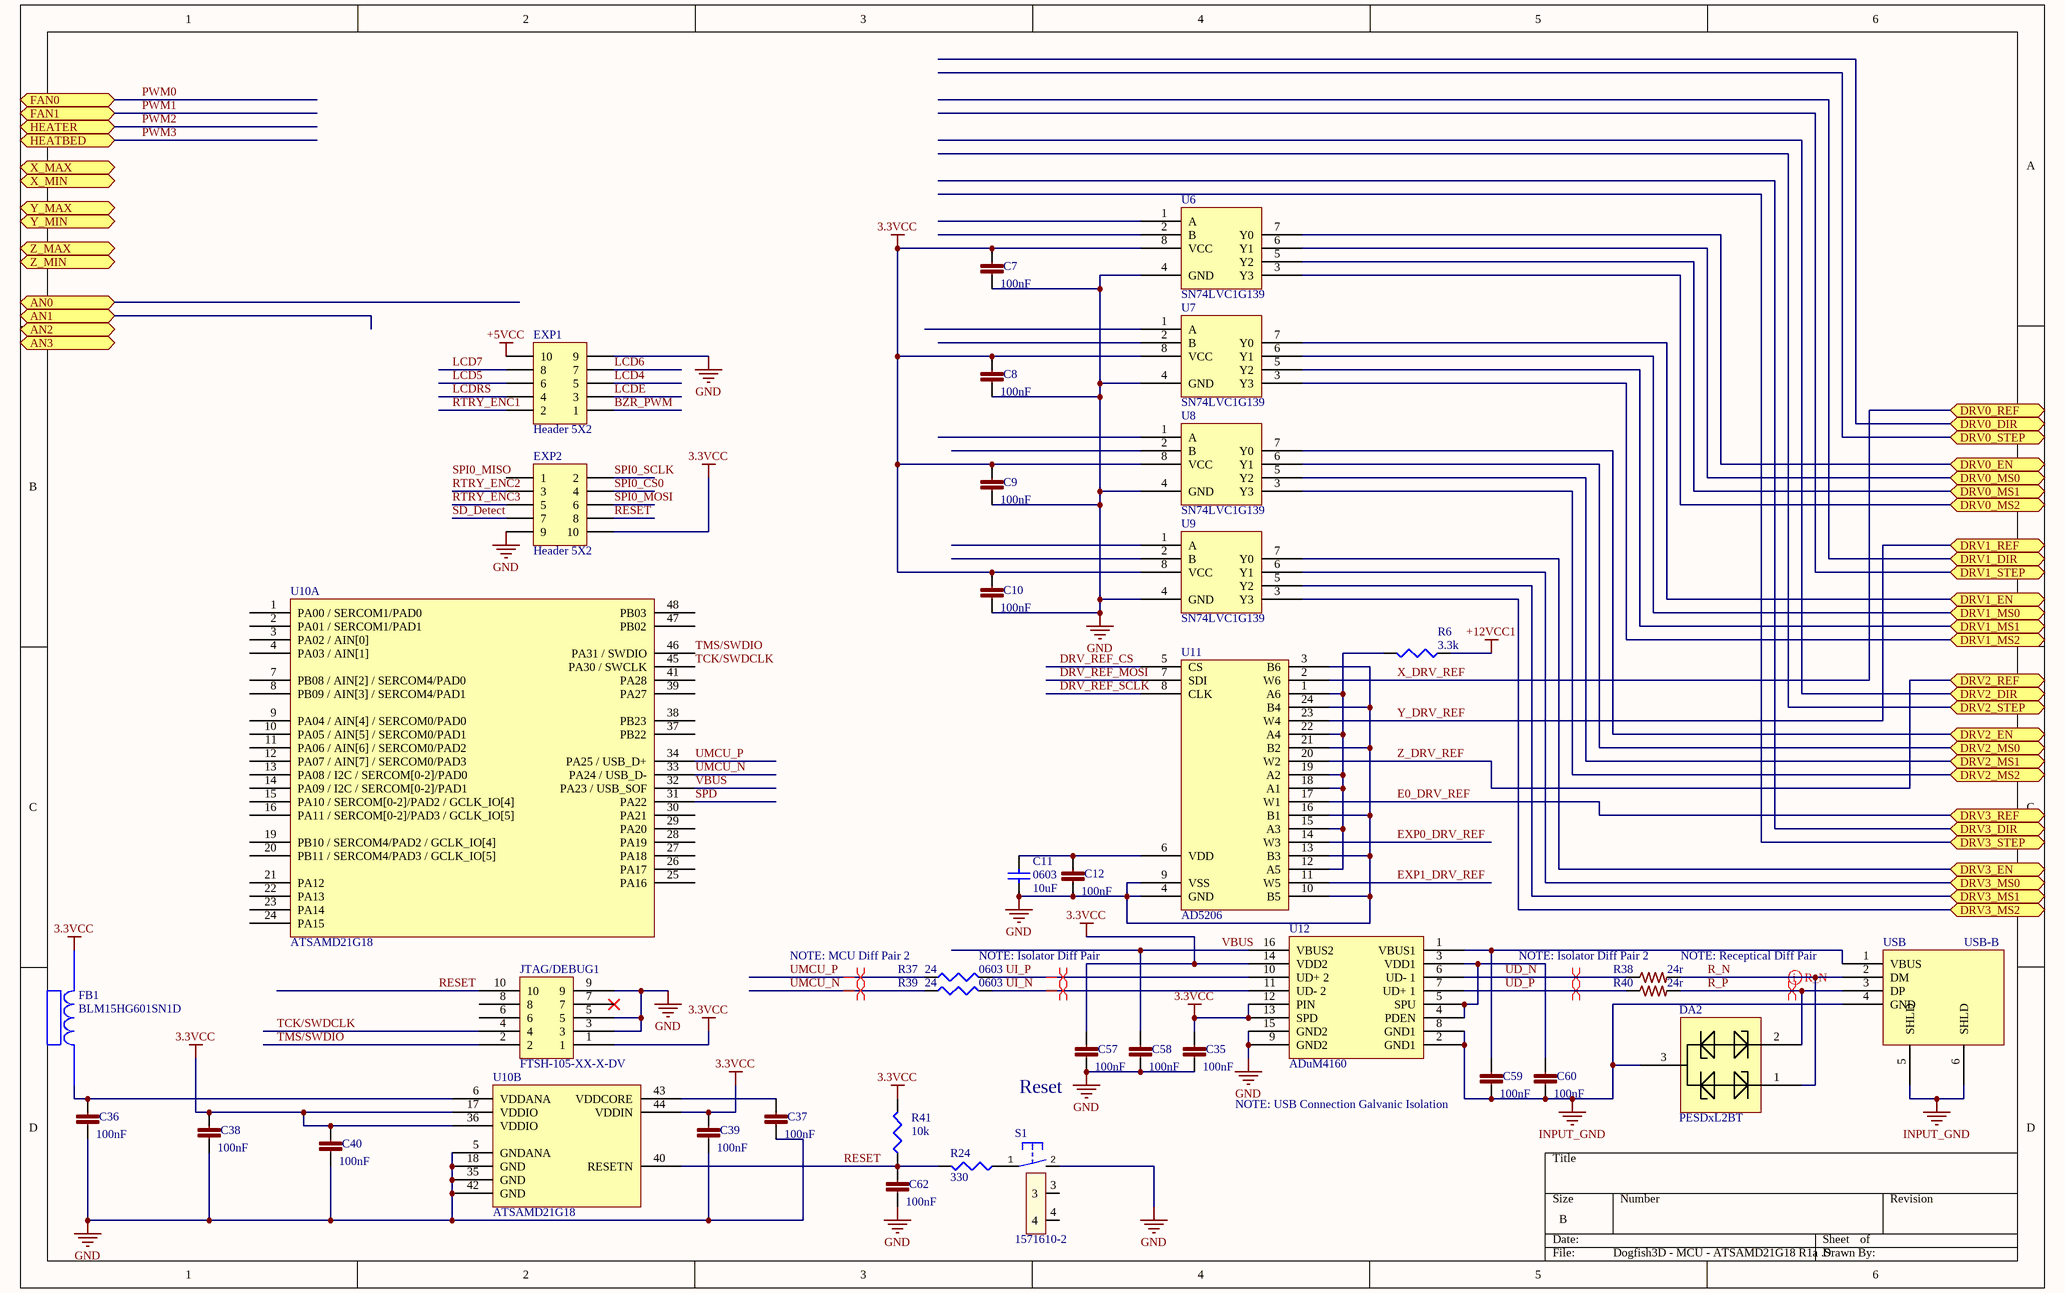
[diagram p6: Dogfish3D - MCU - ATSAMD21G18 R1a .SchDoc]

### Parts
C7  100nF  [C0402]
C8  100nF  [C0402]
C9  100nF  [C0402]
C10  100nF  [C0402]
C11  0603  value 10uF  [1608[0603]]
C12  100nF  [C0402]
C35  100nF  [C0402]
C36  100nF  [C0402]
C37  100nF  [C0402]
C38  100nF  [C0402]
C39  100nF  [C0402]
C40  100nF  [C0402]
C57  100nF  [C0402]
C58  100nF  [C0402]
C59  100nF  [C0402]
C60  100nF  [C0402]
C62  100nF  [C0402]
DA2  PESDxL2BT  [SOT95P230X110-3N]
EXP1  Header 5X2  [HDR2X5]
EXP2  Header 5X2  [HDR2X5]
FB1  BLM15HG601SN1D  [BLM18PG121SN1D]
JTAG/DEBUG1  FTSH-105-XX-X-DV  [FTSH-105-XX-X-DV]
R6  value 3.3k  [J1-0603]  (hidden comment: Res3)
R24  value 330  [J1-0603]  (hidden comment: Res3)
R37  0603  value 24  [J1-0603]
R38  24r  [R0603]
R39  0603  value 24  [J1-0603]
R40  24r  [R0603]
R41  value 10k  [J1-0603]  (hidden comment: Res3)
S1  1571610-2  [B3F-31XX]
U6  SN74LVC1G139  [Ti DCU (R-PDSO-G8) SOIC - SN74VC1G139]
U7  SN74LVC1G139  [Ti DCU (R-PDSO-G8) SOIC - SN74VC1G139]
U8  SN74LVC1G139  [Ti DCU (R-PDSO-G8) SOIC - SN74VC1G139]
U9  SN74LVC1G139  [Ti DCU (R-PDSO-G8) SOIC - SN74VC1G139]
U10  ATSAMD21G18  [TSQFP50P900X900X120-48N]  (parts A,B of 2)
U11  AD5206  [AD5206 & AD5204]
U12  ADuM4160  [ADuM4160]
USB  USB-B  [PN61729]

### Ports
AN0, AN1, AN2, AN3, DRV0_DIR, DRV0_EN, DRV0_MS0, DRV0_MS1, DRV0_MS2, DRV0_REF, DRV0_STEP, DRV1_DIR, DRV1_EN, DRV1_MS0, DRV1_MS1, DRV1_MS2, DRV1_REF, DRV1_STEP, DRV2_DIR, DRV2_EN, DRV2_MS0, DRV2_MS1, DRV2_MS2, DRV2_REF, DRV2_STEP, DRV3_DIR, DRV3_EN, DRV3_MS0, DRV3_MS1, DRV3_MS2, DRV3_REF, DRV3_STEP, FAN0, FAN1, HEATBED, HEATER, X_MAX, X_MIN, Y_MAX, Y_MIN, Z_MAX, Z_MIN

### Nets
3.3VCC: C7.1 C8.1 C9.1 C10.1 C35.1 C38.1 C39.1 C40.1 C57.1 EXP2.10 FB1.2 JTAG/DEBUG1.1 R41.2 U6.8(VCC) U7.8(VCC) U8.8(VCC) U9.8(VCC) U10.17(VDDIO) U10.36(VDDIO) U10.44(VDDIN) U12.12(PIN) U12.13(SPD) U12.14(VDD2)
+5VCC: EXP1.10
+12VCC1: R6.1
GND: C7.2 C8.2 C9.2 C10.2 C11.1 C12.2 C35.2 C36.2 C37.2 C38.2 C39.2 C40.2 C57.2 C58.2 C62.2 EXP1.9 EXP2.9 JTAG/DEBUG1.3 JTAG/DEBUG1.5 JTAG/DEBUG1.9 S1.2(S) U6.4(GND) U7.4(GND) U8.4(GND) U9.4(GND) U10.5(GNDANA) U10.18(GND) U10.35(GND) U10.42(GND) U11.3(B6) U11.4(GND) U11.9(VSS) U11.10(B5) U11.13(B3) U11.16(B1) U11.21(B2) U11.24(B4) U12.9(GND2) U12.15(GND2)
INPUT_GND: C59.2 C60.2 DA2.3 U12.2(GND1) U12.8(GND1) USB.4(GND) USB.5(SHLD) USB.6(SHLD)
BZR_PWM: EXP1.1
DRV_REF_CS: U11.5(CS)
DRV_REF_MOSI: U11.7(SDI)
DRV_REF_SCLK: U11.8(CLK)
E0_DRV_REF: U11.17(W1) ; port DRV3_REF
EN1: U6.7(Y0) ; port DRV0_EN
EN2: U7.7(Y0) ; port DRV1_EN
EN3: U9.7(Y0) ; port DRV3_EN
EN_Z: U8.7(Y0) ; port DRV2_EN
EXP0_DRV_REF: U11.14(W3)
EXP1_DRV_REF: U11.11(W5)
LCD4: EXP1.5
LCD5: EXP1.6
LCD6: EXP1.7
LCD7: EXP1.8
LCDE: EXP1.3
LCDRS: EXP1.4
MOD0E1: U6.6(Y1) ; port DRV0_MS0
MOD0E2: U7.6(Y1) ; port DRV1_MS0
MOD0E3: U9.6(Y1) ; port DRV3_MS0
MOD0E_Z: U8.6(Y1) ; port DRV2_MS0
MOD1E1: U6.5(Y2) ; port DRV0_MS1
MOD1E2: U7.5(Y2) ; port DRV1_MS1
MOD1E3: U9.5(Y2) ; port DRV3_MS1
MOD1E_Z: U8.5(Y2) ; port DRV2_MS1
MOD2E1: U6.3(Y3) ; port DRV0_MS2
MOD2E2: U7.3(Y3) ; port DRV1_MS2
MOD2E3: U9.3(Y3) ; port DRV3_MS2
MOD2E_Z: U8.3(Y3) ; port DRV2_MS2
R_N: DA2.1 R38.2 USB.2(DM)
R_P: DA2.2 R40.2 USB.3(DP)
RESET: C62.1 EXP2.8 JTAG/DEBUG1.10 R24.2 R41.1 U10.40(RESETN)
RTRY_ENC1: EXP1.2
RTRY_ENC2: EXP2.3
RTRY_ENC3: EXP2.5
SD_Detect: EXP2.7
SPD: U10.31(PA22)
SPI0_CS0: EXP2.4
SPI0_MOSI: EXP2.6
SPI0_SCLK: EXP2.2
TCK/SWDCLK: JTAG/DEBUG1.4 U10.45(PA30_/_SWCLK)
TMS/SWDIO: JTAG/DEBUG1.2 U10.46(PA31_/_SWDIO)
UD_N: R38.1 U12.6(UD-_1)
UD_P: R40.1 U12.7(UD+_1)
UI_N: R39.2 U12.11(UD-_2)
UI_P: R37.2 U12.10(UD+_2)
UMCU_N: R39.1 U10.33(PA24_/_USB_D-)
UMCU_P: R37.1 U10.34(PA25_/_USB_D+)
VBUS: C58.1 U10.32(PA23_/_USB_SOF) U12.16(VBUS2)
X_DRV_REF: U11.2(W6) ; port DRV0_REF  [project net REF1]
Y_DRV_REF: U11.23(W4) ; port DRV1_REF  [project net REF2]
Z_DRV_REF: U11.20(W2) ; port DRV2_REF  [project net REF_Z]
NetC11_2: C11.2 C12.1 U11.6(VDD)
NetC36_1: C36.1 FB1.1 U10.6(VDDANA)
NetC37_1: C37.1 U10.43(VDDCORE)
NetC59_1: C59.1 U12.1(VBUS1) USB.1(VBUS)
NetC60_1: C60.1 U12.3(VDD1) U12.4(PDEN) U12.5(SPU)
NetR6_2: R6.2 U11.1(A6) U11.12(A5) U11.15(A3) U11.18(A1) U11.19(A2) U11.22(A4)
NetR24_1: R24.1 S1.1(P)

Not connected (* = marked no-connect by the designer): EXP2 1; JTAG/DEBUG1 6 7* 8; S1 3 4; U6 1(A) 2(B); U7 1(A) 2(B); U8 1(A) 2(B); U9 1(A) 2(B); U10 1(PA00_/_SERCOM1/PAD0) 2(PA01_/_SERCOM1/PAD1) 3(PA02_/_AIN[0]) 4(PA03_/_AIN[1]) 7(PB08_/_AIN[2]_/_SERCOM4/PAD0) 8(PB09_/_AIN[3]_/_SERCOM4/PAD1) 9(PA04_/_AIN[4]_/_SERCOM0/PAD0) 10(PA05_/_AIN[5]_/_SERCOM0/PAD1) 11(PA06_/_AIN[6]_/_SERCOM0/PAD2) 12(PA07_/_AIN[7]_/_SERCOM0/PAD3) 13(PA08_/_I2C_/_SERCOM[0-2]/PAD0) 14(PA09_/_I2C_/_SERCOM[0-2]/PAD1) 15(PA10_/_SERCOM[0-2]/PAD2_/_GCLK_IO[4]) 16(PA11_/_SERCOM[0-2]/PAD3_/_GCLK_IO[5]) 19(PB10_/_SERCOM4/PAD2_/_GCLK_IO[4]) 20(PB11_/_SERCOM4/PAD3_/_GCLK_IO[5]) 21(PA12) 22(PA13) 23(PA14) 24(PA15) 25(PA16) 26(PA17) 27(PA18) 28(PA19) 29(PA20) 30(PA21) 37(PB22) 38(PB23) 39(PA27) 41(PA28) 47(PB02) 48(PB03)

### Layout directives
differential pair: R_N, R_P, UD_N, UD_P, UI_N, UI_P, UMCU_N, UMCU_P

### Notes on the sheet
- NOTE: MCU Diff Pair 2
- (near R37) NOTE: Isolator Diff Pair
- (near R38) NOTE: Isolator Diff Pair 2
- NOTE: Receptical Diff Pair
- (near C57) Reset
- (near C59) NOTE: USB Connection Galvanic Isolation
- Labels drawn without touching a wire or pin: SPI0_MISO

### Library data of the parts
C7-C10 C12 C35-C40 C57-C60 C62 = GRM155R71C104KA88D: as C6 on sheet M; Published: 23-Apr-2014; Publisher: UltiMachine; LastRevisionDate: 23-Apr-2014; ManufacturerPartNumber: GRM155R71C104KA88D; VALUE: 100nF
C11 = Cap Semi: Capacitor (Semiconductor SIM Model); Published: 8-Jun-2000; LatestRevisionDate: 29-May-2009; LatestRevisionNote: IPC-7351 Footprint Added.; PackageReference: C1206; Publisher: Altium Limited; PackageDescription: Chip Capacitor
DA2 = PESDxL2BT: PESDxL2BT TVS Diode Array 2x
EXP1 EXP2 = Header 5X2: Header, 5-Pin, Dual row; LatestRevisionDate: 17-Jul-2002; LatestRevisionNote: Re-released for DXP Platform.; Publisher: Altium Limited
JTAG/DEBUG1 = ARM Cortex JTAG-DEBUG Header
R6 R24 R37 R39 R41 = Res3: Resistor; Published: 8-Jun-2000; LatestRevisionDate: 29-May-2009; LatestRevisionNote: IPC-7351 Footprint Added.; PackageReference: J1-0603; Publisher: Altium Limited; PackageDescription: Chip Resistor
R38 R40 = RC1608F240CS: RES SMD 24 OHM 1% 1/10W 0603; Manufacturer: Samsung; ManufacturerPartNumber: RC0603FR-07100KL; LastRevisionNote: ImportComponents; Published: 23-Apr-2014; Publisher: UltiMachine; LastRevisionDate: 23-Apr-2014; VALUE: 24r; PDF: http://www.samsungsem.com/global/support/library/product-catalog/__icsFiles/afieldfile/2015/01/12/CHIP_RESISTOR_150112_1.pdf
S1 = 1571610-2_1: SWTCH Momentary Washable; Manufacturer: Omron; Manufacturer: TE; LastRevisionNote: Import; ComponentLink1URL: http://www.te.com/commerce/DocumentDelivery/DDEController?Action=srchrtrv&DocNm=1571610&DocType=Customer+Drawing&DocLang=English; ComponentLink1Description: Datasheet for B3F-31XX; Published: 23-Apr-2014; Publisher: UltiMachine; LastRevisionDate: 23-Apr-2014; ManufacturerPartNumber: 1571610-2; Supplier 1: Mouser; Supplier Part Number 1: 506-1571610-2
U12 = ADuM4160: USB Opto Isolator

## Sheet MZ.SchDoc
size A
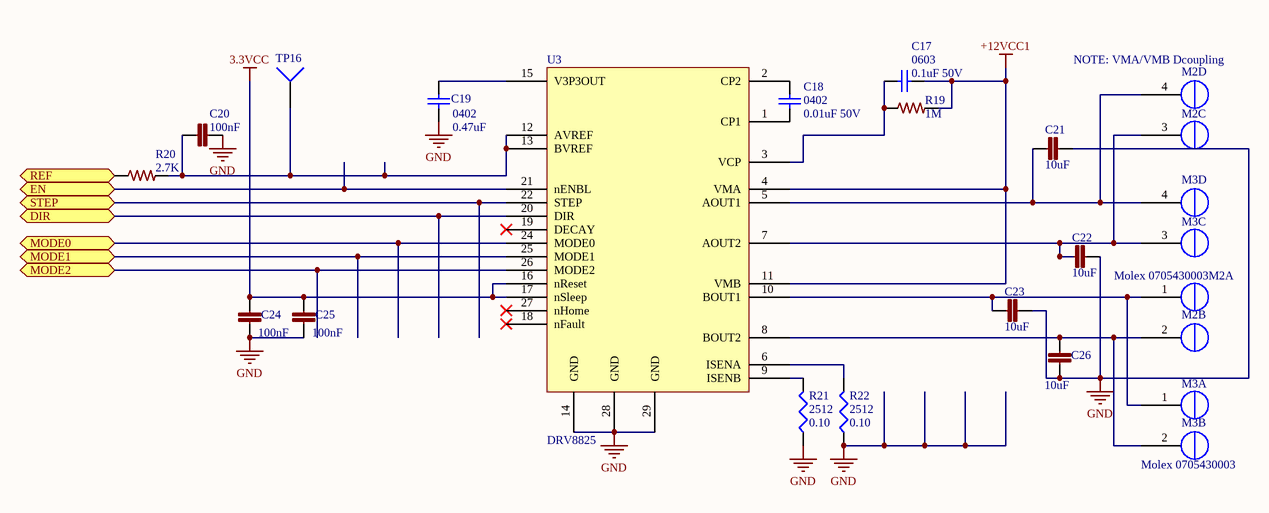
[diagram p7: MZ.SchDoc]

### Parts
C17  0603  value 0.1uF 50V  [1608[0603]]
C18  value 0.01uF 50V  [C0402]  (hidden comment: 0402)
C19  value 0.47uF  [C0402]  (hidden comment: 0402)
C20  100nF  [C0402]
C21  10uF  [C0603]
C22  10uF  [C0603]
C23  10uF  [C0603]
C24  100nF  [C0402]
C25  100nF  [C0402]
C26  10uF  [C0603]
M2  Molex 0705430003  [4POL254]  (parts A,B,C,D of 4)
M3  Molex 0705430003  [4POL254]  (parts A,B,C,D of 4)
R19  1M  [R0402]
R20  2.7K  [R0402]
R21  2512  value 0.10  [2512R-0.55]
R22  2512  value 0.10  [2512R-0.55]
TP16  TP4  [TP-2]  (value not drawn)
U3  DRV8825  [DRV8825PWPR]

### Ports
DIR, EN, MODE0, MODE1, MODE2, REF, STEP

### Nets
3.3VCC: C24.1 C25.1 U3.16(nReset) U3.17(nSleep)
+12VCC1: C17.1 R19.2 U3.4(VMA) U3.11(VMB)
GND: C19.1 C20.2 C21.2 C22.2 C23.2 C24.2 C25.2 C26.2 R21.1 R22.1 U3.14(GND) U3.28(GND) U3.29(GND)
DIR_Z: U3.20(DIR) ; port DIR
EN_Z: U3.21(nENBL) ; port EN
MOD0E_Z: U3.24(MODE0) ; port MODE0
MOD1E_Z: U3.25(MODE1) ; port MODE1
MOD2E_Z: U3.26(MODE2) ; port MODE2
REF_Z: R20.1 ; port REF
STEP_Z: U3.22(STEP) ; port STEP
NetC17_2: C17.2 R19.1 U3.3(VCP)
NetC18_1: C18.1 U3.1(CP1)
NetC18_2: C18.2 U3.2(CP2)
NetC19_2: C19.2 U3.15(V3P3OUT)
NetC20_1: C20.1 R20.2 TP16.1 U3.12(AVREF) U3.13(BVREF)
NetC21_1: C21.1 M2.4(OUT1B) M3.4(OUT1B) U3.5(AOUT1)
NetC22_1: C22.1 M2.3(OUT1A) M3.3(OUT1A) U3.7(AOUT2)
NetC23_1: C23.1 M2.1(OUT2B) M3.1(OUT2B) U3.10(BOUT1)
NetC26_1: C26.1 M2.2(OUT2A) M3.2(OUT2A) U3.8(BOUT2)
NetR21_2: R21.2 U3.9(ISENB)
NetR22_2: R22.2 U3.6(ISENA)

Not connected (* = marked no-connect by the designer): U3 18(nFault)* 19(DECAY)* 23(NC) 27(nHome)*

### Notes on the sheet
- (near M2) NOTE: VMA/VMB Dcoupling

### Library data of the parts
C17 = Cap Semi: Capacitor (Semiconductor SIM Model); Published: 8-Jun-2000; LatestRevisionDate: 29-May-2009; LatestRevisionNote: IPC-7351 Footprint Added.; PackageReference: C1206; Publisher: Altium Limited; PackageDescription: Chip Capacitor
C18 = GRM155R71H103JA88D: as C4 on sheet M; Published: 10 - Dec - 2014; LatestRevisionDate: 10 - Dec - 2014; LatestRevisionNote: Ultimachine Footprint Added; Publisher: Ultimachine; Component Type: Chip Capacitor; MFR Part #: GRM155R71H103JA88D; Part Description: CAP CER 10000PF 50V X7R 0402; Mounting Type: SMT 0402; Datasheet: http://search.murata.co.jp/Ceramy/image/img/A01X/G101/ENG/GRM155R71H103JA88-01.pdf; Height: 0.5 ±0.05mm; Digikey #: 490-7763-1-ND; PackageReference: 0402
C19 = GRM155R60J474KE19D: as C5 on sheet M; Published: 10 - Dec - 2014; LatestRevisionDate: 10 - Dec - 2014; LatestRevisionNote: Ultimachine Footprint Added; Publisher: Ultimachine; Component Type: Chip Capacitor; MFR Part #: GRM155R60J474KE19D; Mounting Type: SMT 0402; Datasheet: http://search.murata.co.jp/Ceramy/image/img/A01X/G101/ENG/GRM155R60J474KE19-01.pdf; Height: 0.5 ±0.05mm; PackageReference: 0402
C20 C24 C25 = GRM155R71C104KA88D: as C6 on sheet M; Published: 23-Apr-2014; Publisher: UltiMachine; LastRevisionDate: 23-Apr-2014; ManufacturerPartNumber: GRM155R71C104KA88D; VALUE: 100nF
C21-C23 C26 = CC0603ZRY5V6BB105: as C41 on sheet M; Published: 23-Apr-2014; Publisher: UltiMachine; LastRevisionDate: 23-Apr-2014; ManufacturerPartNumber: CC0603ZRY5V6BB105; VALUE: 10uF
M2 M3 = Molex 0705430003 Alt: Molex 4 Pin Clip Connector
R19 = ERJ2GEJ105X: as R3 on sheet M; Published: 23-Apr-2014; Publisher: UltiMachine; LastRevisionDate: 23-Apr-2014; ManufacturerPartNumber: ERJ2GEJ105X; VALUE: 1M
R20 = ERJ-2RKF2701X: as R4 on sheet M; Published: 23-Apr-2014; Publisher: Adam; LastRevisionDate: 23-Apr-2014; VALUE: 2.7K
R21 R22 = CSRN2512FTR100: as R5 on sheet M; PackageReference: 2512; MFR #: CSRN2512FTR100; Digikey #: CSRN2512FTR100TR-ND; PDF: http://www.seielect.com/catalog/SEI-CSR_CSRN.pdf
TP16 = Socket: LatestRevisionDate: 17-Jul-2002; LatestRevisionNote: Re-released for DXP Platform.; Publisher: Altium Limited
U3 = DRV8825: as U1 on sheet M; Part Number: DRV8825PWPR; Status: In-Production; Pins: 28 Pins and one Exposed Pad; Datasheet: http://www.ti.com/lit/gpn/drv8825; Height: 1.2mm; Tolerance: N/A; Type: Stepper Driver - Integrated Circuit; Lead Free: YES

## Nets that join several sheets
3.3VCC: Dogfish3D - Driver Channel1 (C44D.1 C45D.1 U1D.16 U1D.17), Dogfish3D - Driver Channel2 (C44B.1 C45B.1 U1B.16 U1B.17), Dogfish3D - Driver Channel3 (C44C.1 C45C.1 U1C.16 U1C.17), U_Dogfish3D - Endstop Channel1 (MAX1A.3 MIN1A.3 R1A.2 R2A.2), U_Dogfish3D - Endstop Channel2 (MAX1B.3 MIN1B.3 R1B.2 R2B.2), U_Dogfish3D - Endstop Channel3 (MAX1C.3 MIN1C.3 R1C.2 R2C.2), MOSFETs and Driver (C13.2 C16.2 U2.1), Power (C33.1 R30.2 U5.3), U_Dogfish3D - Thermistor Channel1 (R43A.2), U_Dogfish3D - Thermistor Channel2 (R43B.2), Dogfish3D - MCU - ATSAMD21G18 R1a  (23 pins), MZ (C24.1 C25.1 U3.16 U3.17)
+5VCC: MOSFETs and Driver (C14.2 C15.2 U2.14), Power (9 pins), Dogfish3D - MCU - ATSAMD21G18 R1a  (EXP1.10)
+12VCC1: Dogfish3D - Driver Channel1 (C3D.2 R3D.2 U1D.4 U1D.11), Dogfish3D - Driver Channel2 (C3B.2 R3B.2 U1B.4 U1B.11), Dogfish3D - Driver Channel3 (C3C.2 R3C.2 U1C.4 U1C.11), Power (C66.1 D25.C F3.2), Dogfish3D - MCU - ATSAMD21G18 R1a  (R6.1), MZ (C17.1 R19.2 U3.4 U3.11)
+12VCC2: MOSFETs and Driver (7 pins), Power (7 pins)
+12VCC3: MOSFETs and Driver (D10.C R16.2 T2.2), Power (C64.1 D17.C F1.2)
GND: Dogfish3D - Driver Channel1 (13 pins), Dogfish3D - Driver Channel2 (13 pins), Dogfish3D - Driver Channel3 (13 pins), U_Dogfish3D - Endstop Channel1 (5 pins), U_Dogfish3D - Endstop Channel2 (5 pins), U_Dogfish3D - Endstop Channel3 (5 pins), MOSFETs and Driver (18 pins), Power (28 pins), U_Dogfish3D - Thermistor Channel1 (C63A.2 D24A.A P2A.2), U_Dogfish3D - Thermistor Channel2 (C63B.2 D24B.A P2B.2), Dogfish3D - MCU - ATSAMD21G18 R1a  (39 pins), MZ (13 pins)
E0_DRV_REF: Dogfish3D - Driver Channel3 (R4C.1), Dogfish3D - MCU - ATSAMD21G18 R1a  (U11.17)
EN1: Dogfish3D - Driver Channel1 (U1D.21), Dogfish3D - MCU - ATSAMD21G18 R1a  (U6.7)
EN2: Dogfish3D - Driver Channel2 (U1B.21), Dogfish3D - MCU - ATSAMD21G18 R1a  (U7.7)
EN3: Dogfish3D - Driver Channel3 (U1C.21), Dogfish3D - MCU - ATSAMD21G18 R1a  (U9.7)
EN_Z: Dogfish3D - MCU - ATSAMD21G18 R1a  (U8.7), MZ (U3.21)
MOD0E1: Dogfish3D - Driver Channel1 (U1D.24), Dogfish3D - MCU - ATSAMD21G18 R1a  (U6.6)
MOD0E2: Dogfish3D - Driver Channel2 (U1B.24), Dogfish3D - MCU - ATSAMD21G18 R1a  (U7.6)
MOD0E3: Dogfish3D - Driver Channel3 (U1C.24), Dogfish3D - MCU - ATSAMD21G18 R1a  (U9.6)
MOD0E_Z: Dogfish3D - MCU - ATSAMD21G18 R1a  (U8.6), MZ (U3.24)
MOD1E1: Dogfish3D - Driver Channel1 (U1D.25), Dogfish3D - MCU - ATSAMD21G18 R1a  (U6.5)
MOD1E2: Dogfish3D - Driver Channel2 (U1B.25), Dogfish3D - MCU - ATSAMD21G18 R1a  (U7.5)
MOD1E3: Dogfish3D - Driver Channel3 (U1C.25), Dogfish3D - MCU - ATSAMD21G18 R1a  (U9.5)
MOD1E_Z: Dogfish3D - MCU - ATSAMD21G18 R1a  (U8.5), MZ (U3.25)
MOD2E1: Dogfish3D - Driver Channel1 (U1D.26), Dogfish3D - MCU - ATSAMD21G18 R1a  (U6.3)
MOD2E2: Dogfish3D - Driver Channel2 (U1B.26), Dogfish3D - MCU - ATSAMD21G18 R1a  (U7.3)
MOD2E3: Dogfish3D - Driver Channel3 (U1C.26), Dogfish3D - MCU - ATSAMD21G18 R1a  (U9.3)
MOD2E_Z: Dogfish3D - MCU - ATSAMD21G18 R1a  (U8.3), MZ (U3.26)
NetD18_C: Power (D18.C R29.1), U_Dogfish3D - Thermistor Channel1 (D23A.C), U_Dogfish3D - Thermistor Channel2 (D23B.C)
REF1: Dogfish3D - Driver Channel1 (R4D.1), Dogfish3D - MCU - ATSAMD21G18 R1a  (U11.2)
REF2: Dogfish3D - Driver Channel2 (R4B.1), Dogfish3D - MCU - ATSAMD21G18 R1a  (U11.23)
REF_Z: Dogfish3D - MCU - ATSAMD21G18 R1a  (U11.20), MZ (R20.1)